# EAGLE design SH-SwitchNode-CT1 Shield (EAGLE 7.2.0)
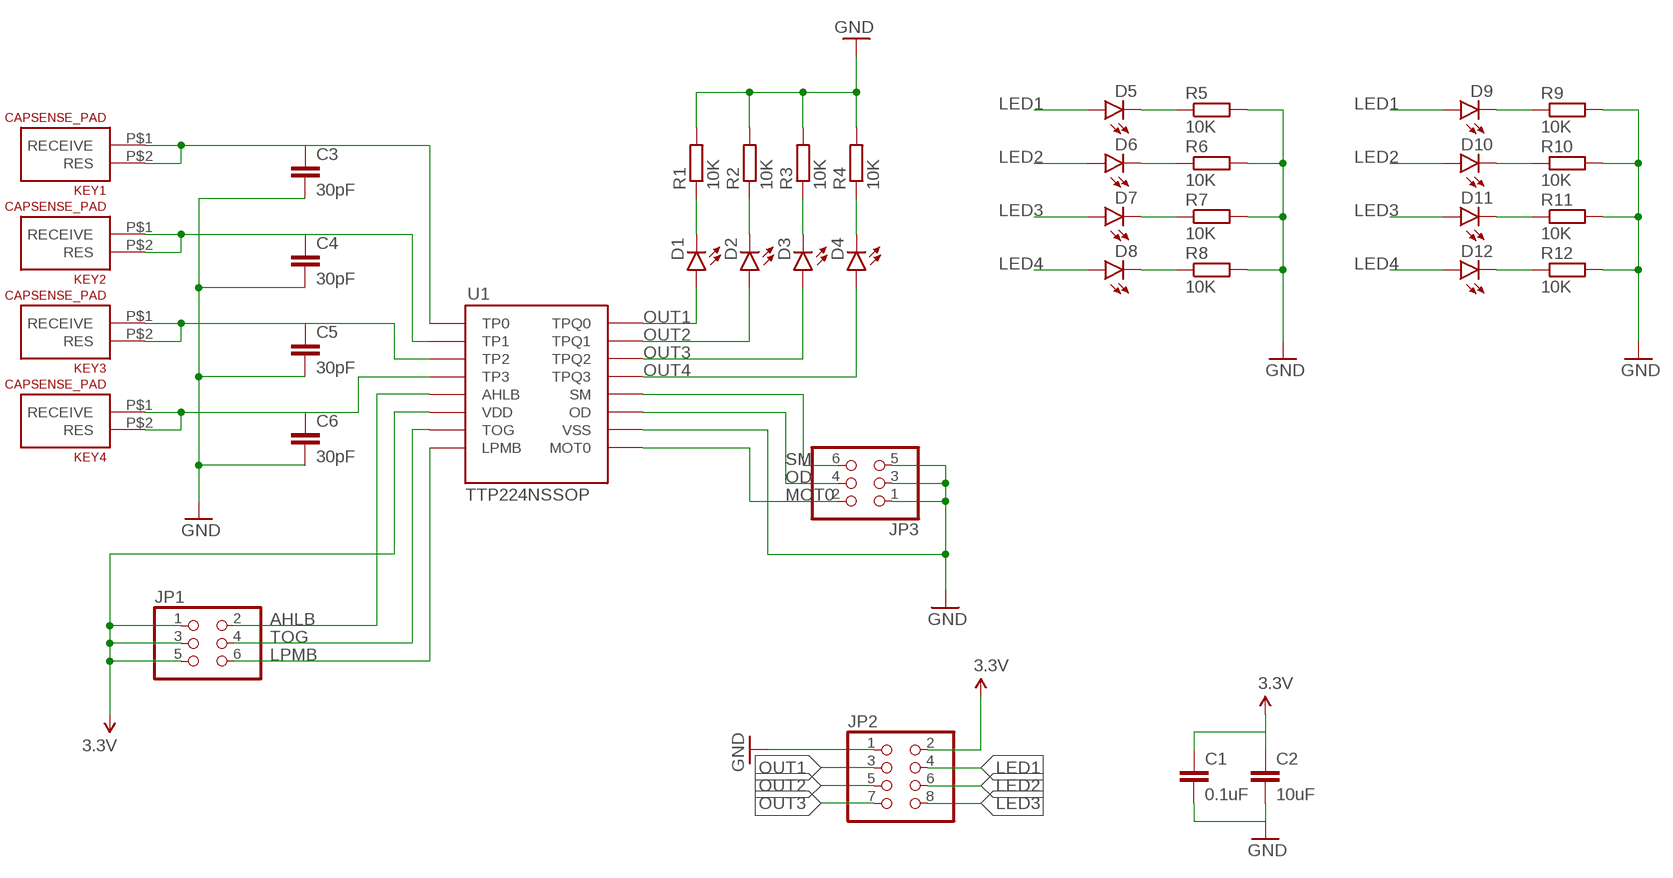
[diagram p0: schematic, sheet 1]

## Parts
C1  0.1uF  CAP0805  [0805]
C2  10uF  CAP0805  [0805]
C3  30pF  CAP0805  [0805]
C4  30pF  CAP0805  [0805]
C5  30pF  CAP0805  [0805]
C6  30pF  CAP0805  [0805]
D1  LED1206-BOTTOM  [LED-1206-BOTTOM]
D2  LED1206-BOTTOM  [LED-1206-BOTTOM]
D3  LED1206-BOTTOM  [LED-1206-BOTTOM]
D4  LED1206-BOTTOM  [LED-1206-BOTTOM]
D5  LED1206-BOTTOM  [LED-1206-BOTTOM]
D6  LED1206-BOTTOM  [LED-1206-BOTTOM]
D7  LED1206-BOTTOM  [LED-1206-BOTTOM]
D8  LED1206-BOTTOM  [LED-1206-BOTTOM]
D9  LED1206-BOTTOM  [LED-1206-BOTTOM]
D10  LED1206-BOTTOM  [LED-1206-BOTTOM]
D11  LED1206-BOTTOM  [LED-1206-BOTTOM]
D12  LED1206-BOTTOM  [LED-1206-BOTTOM]
JP1  PINHD-2X3  [2X03]
JP2  PINHD-2X4  [2X04]
JP3  PINHD-2X3  [2X03]
KEY1  CAPSENSE_PAD  [CAPSENSE_PAD]
KEY2  CAPSENSE_PAD  [CAPSENSE_PAD]
KEY3  CAPSENSE_PAD  [CAPSENSE_PAD]
KEY4  CAPSENSE_PAD  [CAPSENSE_PAD]
R1  10K  R-EU_R0805  [R0805]
R2  10K  R-EU_R0805  [R0805]
R3  10K  R-EU_R0805  [R0805]
R4  10K  R-EU_R0805  [R0805]
R5  10K  R-EU_R0805  [R0805]
R6  10K  R-EU_R0805  [R0805]
R7  10K  R-EU_R0805  [R0805]
R8  10K  R-EU_R0805  [R0805]
R9  10K  R-EU_R0805  [R0805]
R10  10K  R-EU_R0805  [R0805]
R11  10K  R-EU_R0805  [R0805]
R12  10K  R-EU_R0805  [R0805]
U1  TTP224NSSOP  [SSOP16]

## Nets
3.3V: C1.1 C2.1 JP1.1 JP1.3 JP1.5 JP2.2 U1.6(VDD)
AHLB: JP1.2 U1.5(AHLB)
GND: C1.2 C2.2 C3.2 C4.2 C5.2 C6.2 JP2.1 JP3.1 JP3.3 JP3.5 R1.2 R2.2 R3.2 R4.2 R5.2 R6.2 R7.2 R8.2 R9.2 R10.2 R11.2 R12.2 U1.10(VSS)
KEY1: C3.1 KEY1.P$1(RECEIVE) KEY1.P$2(RES) U1.1(TP0)
KEY2: C4.1 KEY2.P$1(RECEIVE) KEY2.P$2(RES) U1.2(TP1)
KEY3: C5.1 KEY3.P$1(RECEIVE) KEY3.P$2(RES) U1.3(TP2)
KEY4: C6.1 KEY4.P$1(RECEIVE) KEY4.P$2(RES) U1.4(TP3)
LED1: D5.A D9.A JP2.4
LED2: D6.A D10.A JP2.6
LED3: D7.A D11.A JP2.8
LED4: D8.A D12.A
LPMB: JP1.6 U1.8(LPMB)
MOT0: JP3.2 U1.9(MOT0)
N$6: D5.C R5.1
N$7: D6.C R6.1
N$11: D1.C R1.1
N$12: D7.C R7.1
N$13: D8.C R8.1
N$16: D9.C R9.1
N$18: D2.C R2.1
N$19: D3.C R3.1
N$20: D4.C R4.1
N$21: D10.C R10.1
N$22: D11.C R11.1
N$23: D12.C R12.1
OD: JP3.4 U1.11(OD)
OUT1: D1.A JP2.3 U1.16(TPQ0)
OUT2: D2.A JP2.5 U1.15(TPQ1)
OUT3: D3.A JP2.7 U1.14(TPQ2)
OUT4: D4.A U1.13(TPQ3)
SM: JP3.6 U1.12(SM)
TOG: JP1.4 U1.7(TOG)

## Library data of the parts
C1-C6 = SparkFun-Capacitors:CAP: Capacitor Standard 0603 ceramic capacitor, and 0.1" leaded capacitor.
D1-D12 = SparkFun-LED:LED: LEDs Standard schematic elements and footprints for 5mm, 3mm, 1206, and 0603 sized LEDs. 5mm - Spark Fun Electronics SKU : COM-00529 (and others)
JP1 JP3 = SparkFun-Connectors:PINHD-2X3: PIN HEADER
JP2 = adafruit:PINHD-2X4: PIN HEADER
KEY1-KEY4 = SparkFun-Electromechanical:CAPSENSE_PAD: Generic copper pad for a capacitive touch sensor.
R1-R12 = rcl:R-EU_: RESISTOR, European symbol
U1 = My Eagle Lib:TTP224N: The TTP224N-BSB TonTouchTM IC is capacitive sensing design specifically for touch pad controls. The device built in regulator for touch sensor. Stable sensing method can cover diversity conditions. Human interfaces control panel links through non-conductive dielectric material. The main application is focused at replacing of the mechanical switch or button. The ASSP can independently handle the 4 touch pads with 4 direct output pins.

## Board
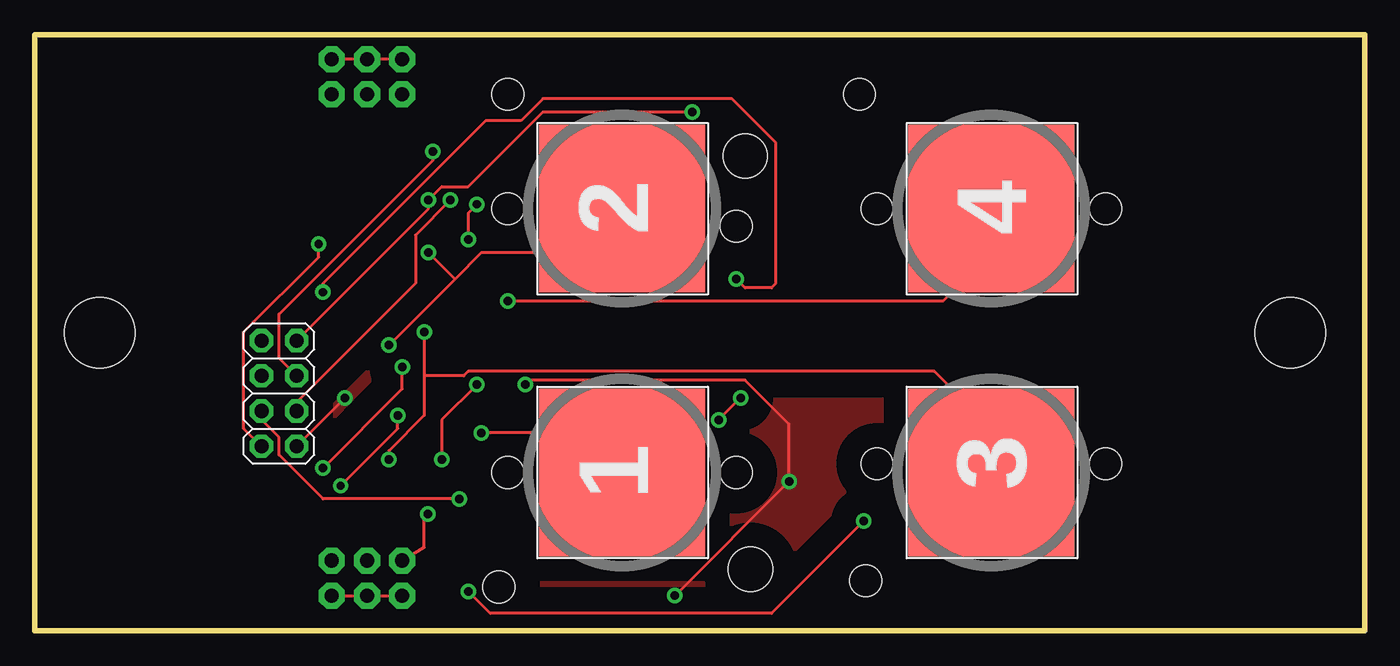
[diagram p1: board, top side]
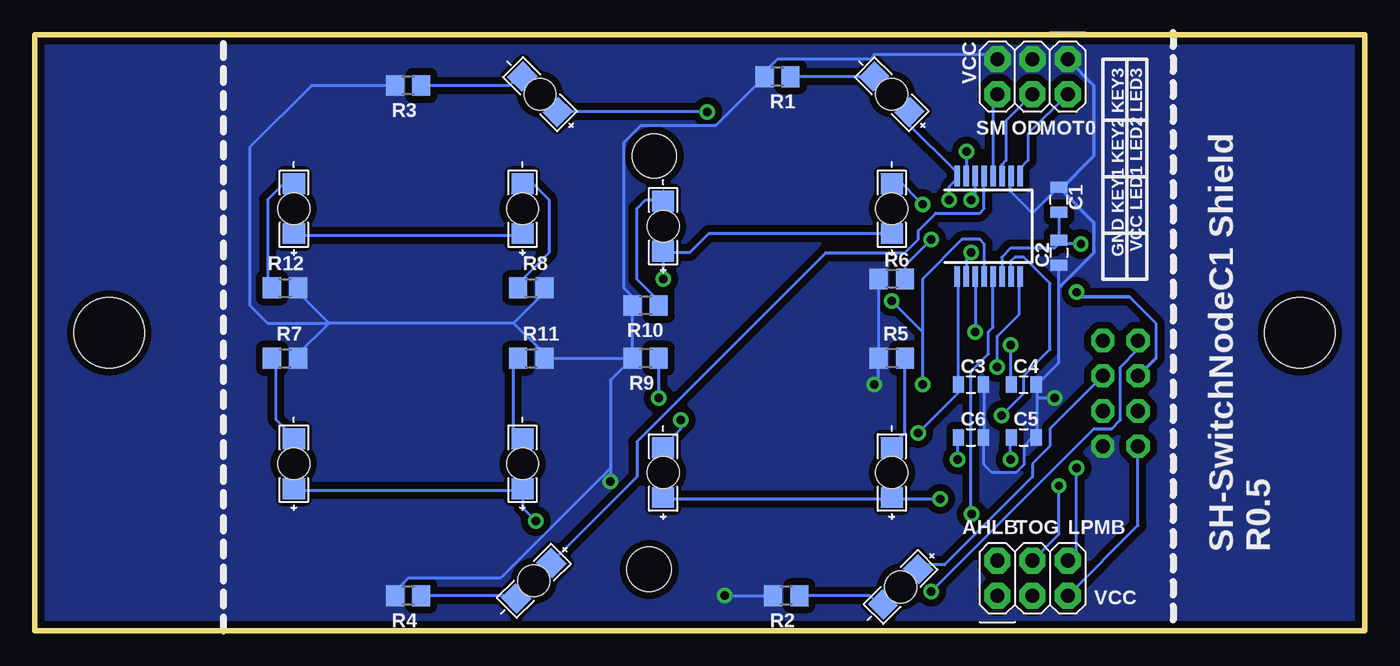
[diagram p2: board, bottom side, seen from below]

Size 96.06 x 43.04 mm. Coordinates in mm from the lower left corner, seen from the top.
Outline: 0,0 96.06,0 96.06,43.04 0,43.04 0,0
Copper layers (1*16): Top 0.035mm / dielectric 1.5mm / Bottom 0.035mm
Design rules "default *": minimum track width 9mil, minimum drill 24mil, track to track 10mil, track to pad 10mil, pad to pad 10mil, via to via 10mil, smd to smd 8mil, copper to edge 20mil, drill to drill 12mil, minimum pad ring 13mil, minimum via ring 10mil, stop-mask expansion 4mil, vias tented up to drill 0mil, thermal gap 10mil
Holes 3.2 mm at 51.31,34.29 51.69,4.45
Holes 5.08 mm at 4.7,21.52 90.68,21.52

### Footprints (pad centres in the part's own frame; a part is rotated, then mirrored left to right if it is on the bottom)
0805 = smd 0.8 x 1.2: 1 -0.9,0; 2 0.9,0
LED-1206-BOTTOM = smd 1.5 x 1.6: A -1.8,0; C 1.8,0 | hole 2.3: 0,0
2X03 = drill 1.016 pad 1.88 octagon: 1 -2.54,-1.27; 2 -2.54,1.27; 3 0,-1.27; 4 0,1.27; 5 2.54,-1.27; 6 2.54,1.27
2X04 = drill 1.016 pad 1.676 octagon: 1 -3.81,-1.27; 2 -3.81,1.27; 3 -1.27,-1.27; 4 -1.27,1.27; 5 1.27,-1.27; 6 1.27,1.27; 7 3.81,-1.27; 8 3.81,1.27
CAPSENSE_PAD = smd 12 x 6.1: P$1 0,3; P$2 0,-3
R0805 = smd 1.3 x 1.5: 1 -0.95,0; 2 0.95,0
SSOP16 = smd 0.4 x 1.5: 1 -2.275,-3.625; 2 -1.625,-3.625; 3 -0.975,-3.625; 4 -0.325,-3.625; 5 0.325,-3.625; 6 0.975,-3.625; 7 1.625,-3.625; 8 2.275,-3.625; 9 2.275,3.625; 10 1.625,3.625; 11 0.975,3.625; 12 0.325,3.625; 13 -0.325,3.625; 14 -0.975,3.625; 15 -1.625,3.625; 16 -2.275,3.625

### Placement (x,y rotation side)
C1  22.1,31.11 90 bottom
C2  22.1,27.3 270 bottom
C3  28.45,17.78 0 bottom
C4  24.64,17.78 0 bottom
C5  24.64,13.97 0 bottom
C6  28.45,13.97 0 bottom
D1  34.16,38.73 135 bottom
D2  33.53,3.17 225 bottom
D3  59.56,38.73 135 bottom
D4  60.01,3.62 225 bottom
D5  34.16,11.43 90 bottom
D6  34.16,30.48 90 bottom
D7  77.34,12.06 90 bottom
D8  60.83,30.48 90 bottom
D9  50.67,11.43 90 bottom
D10  50.67,29.21 90 bottom
D11  60.83,12.06 90 bottom
D12  77.34,30.48 90 bottom
JP1  24,3.81 0 bottom
JP2  17.65,17.14 90 top
JP3  24,40 180 bottom
KEY1  42.42,11.43 0 top
KEY2  42.42,30.48 0 top
KEY3  69.09,11.43 0 top
KEY4  69.09,30.48 0 top
R1  42.42,40 180 bottom
R2  41.78,2.54 180 bottom
R3  69.09,39.37 180 bottom
R4  69.09,2.54 180 bottom
R5  34.16,19.68 180 bottom
R6  34.16,25.4 180 bottom
R7  77.98,19.68 0 bottom
R8  60.2,24.77 0 bottom
R9  51.94,19.68 180 bottom
R10  51.94,23.49 180 bottom
R11  60.2,19.68 0 bottom
R12  77.98,24.77 0 bottom
U1  27.18,29.21 0 bottom

### Tracks (layer width: path | path; a pad name or v marks a point on that pad's centre or on a via)
3.3V  (via drill 0.61)
  Top 0.229: JP1.5 JP1.3 JP1.1 | v20.51,27.94 20.51,26.99 15.11,21.59 15.11,14.6 JP2.2
  Bottom 0.229: C1.1 C2.1 22.1,27.94 | 22.1,27.94 22.42,27.62 25.59,27.62 26.23,26.99 26.23,25.72 U1.6 | JP2.2 16.38,7.62 JP1.5 | v20.51,27.94 22.1,27.94
AHLB  (via drill 0.61)
  Top 0.229: JP1.2 28.13,6.03 28.13,8.19 v28.38,8.45
  Bottom 0.229: U1.5 26.86,25.4 26.86,21.91 27.18,21.59 27.18,20 28.45,18.73 28.45,8.51 v28.38,8.45
GND  (via drill 0.61)
  Top 0.229: JP3.1 JP3.3 JP3.5 | v22.42,16.83 JP2.1 | v46.23,2.54 v54.48,10.79 54.48,14.92 51.31,18.1 35.75,18.1 v35.43,17.78
  Bottom 0.229: JP3.5 26.86,41.59 35.43,41.59 35.75,41.27 42.42,41.27 43.05,40.64 43.05,40 R1.2 46.86,36.51 52.26,36.51 53.53,35.24 53.53,24.77 52.9,24.13 | 27.5,13.97 27.5,17.78 C3.2 | 23.69,17.78 23.69,16.83 | 23.69,16.83 23.69,13.97 C5.2 24,13.97 24.64,13.34 24.64,12 25.21,11.43 26.92,11.43 27.5,12 27.5,13.97 | C2.2 22.1,24.77 22.1,19.37 23.69,17.78 | 23.69,17.78 C4.2 | U1.10 25.59,32.7 25.59,31.75 24,30.16 22.1,32.07 C1.2 22.1,31.75 | 27.5,13.97 C6.2 | 23.69,16.83 v22.42,16.83 | 77.03,24.45 R12.2 77.03,24.45 | R7.2 77.03,20 74.8,22.22 | R8.2 59.56,24.77 59.56,24.13 61.47,22.22 | R5.2 R6.2 | v46.23,2.54 R2.2 | 54.48,11.75 54.48,18.1 R9.2 | 54.48,11.75 v54.48,10.79 | R9.2 52.9,24.13 | R9.2 R11.2 59.88,19.68 59.56,20 59.56,20.32 61.47,22.22 | 54.48,11.75 62.42,3.81 69.09,3.81 69.72,3.17 69.72,2.54 R4.2 | R5.2 35.12,18.1 v35.43,17.78 | R5.2 | 61.47,22.22 74.8,22.22 | 52.9,24.13 R10.2 | 77.03,24.45 74.8,22.22 | R3.2 76.07,39.37 80.52,34.92 80.52,23.49 79.25,22.22 74.8,22.22
  Bottom 0.254: 22.1,31.75 19.56,34.29 19.56,39.37 JP3.1 | 22.1,24.77 19.56,27.3 19.56,29.47 C1.2
  pour Top (isolate 1.778, no thermals): -3.94,46.99 100.2,46.99 100.2,-5.72 -3.94,-5.72
  pour Bottom (isolate 0.508, no thermals): -3.94,46.99 100.2,46.99 100.2,-5.72 -3.94,-5.72
KEY1  (via drill 0.61)
  Top 0.229: 42.42,14.29 v32.26,14.29 | 42.42,14.29 KEY1.P$2 | 42.42,14.29 KEY1.P$1
  Bottom 0.229: 29.4,17.78 29.4,25.4 U1.1 | 29.4,17.78 29.4,17.14 v32.26,14.29 | 29.4,17.78 C3.1
KEY2  (via drill 0.61)
  Top 0.229: 30.35,25.4 32.26,27.3 42.42,27.3 KEY2.P$2 KEY2.P$1 | 30.35,25.4 v25.59,20.64 | 30.35,25.4 v28.45,27.3
  Bottom 0.229: v25.59,20.64 25.59,17.78 C4.1 | v28.45,27.3 28.77,26.99 28.77,25.72 U1.2
KEY3  (via drill 0.61)
  Top 0.229: v25.59,12.38 25.59,13.02 28.13,15.56 28.13,18.41 | v28.13,21.59 28.13,18.41 | 28.13,18.41 30.99,18.41 31.31,18.73 64.96,18.73 69.09,14.6 KEY3.P$1 KEY3.P$2
  Bottom 0.229: v25.59,12.38 25.59,13.97 C5.1 | v28.13,21.59 28.13,25.4 U1.3
KEY4  (via drill 0.61)
  Top 0.229: v29.4,12.38 29.4,15.24 v31.94,17.78 | v34.16,23.81 65.59,23.81 69.09,27.3 KEY4.P$2 KEY4.P$1
  Bottom 0.229: v29.4,12.38 29.4,13.97 C6.1 | 31.94,21.59 31.94,25.4 29.08,28.26 27.81,28.26 27.5,27.94 27.5,25.72 U1.4 | 31.94,21.59 v31.94,17.78 | v34.16,23.81 31.94,21.59
LED1  (via drill 0.61)
  Top 0.229: JP2.4 16.38,15.24 17.65,13.97 17.65,12.7 20.83,9.52 v30.67,9.52
  Bottom 0.229: 34.16,9.52 50.67,9.52 D9.A | 34.16,9.52 v30.67,9.52 | 34.16,9.52 D5.A
LED2  (via drill 0.61)
  Top 0.229: v20.83,24.45 20.83,25.08 32.58,36.83 35.12,36.83 36.7,38.42 50.35,38.42 53.53,35.24 53.53,25.08 53.21,24.77 51.31,24.77 v50.67,25.4
  Bottom 0.229: 50.67,27.3 D10.A | 15.11,19.68 15.11,22.22 17.02,24.13 | D6.A 47.39,28.68 48.77,27.3 50.57,27.3 D10.A | D10.A v50.67,25.4
  Bottom 0.254: 17.02,24.13 20.51,24.13 v20.83,24.45 | 15.11,19.68 JP2.6
LED3  (via drill 0.61)
  Top 0.229: v31.31,2.86 32.89,1.27 53.21,1.27 v59.88,7.94
  Bottom 0.229: 60.83,10.16 77.34,10.16 D7.A | JP2.8 16.38,20.32 17.65,19.05 17.65,15.24 18.29,14.6 19.56,14.6 v31.31,2.86 | 60.83,10.16 D11.A | 60.83,10.16 60.83,8.89 v59.88,7.94
LED4
  Bottom 0.229: D8.A 60.83,28.58 77.34,28.58 D12.A
LPMB  (via drill 0.61)
  Top 0.229: v26.54,19.05 26.54,17.46 v20.83,11.75
  Bottom 0.229: v26.54,19.05 26.54,21.27 24.96,22.86 24.96,25.4 U1.8 | v20.83,11.75 20.83,5.71 JP1.6
MOT0
  Bottom 0.229: JP3.2 24.32,35.88 24.32,33.97 24.96,33.34 24.96,33.02 U1.9
N$6
  Bottom 0.229: R5.1 33.21,14.29 34.16,13.34 D5.C
N$7  (via drill 0.61)
  Top 0.229: v31.31,28.26 31.31,30.16 v31.94,30.8
  Bottom 0.229: v31.31,28.26 33.21,26.35 R6.1 | v31.94,30.8 33.85,32.7 34.16,32.38 D6.C
N$11
  Bottom 0.229: R1.1 35.75,40 D1.C
N$12
  Bottom 0.229: R7.1 78.61,19.68 78.61,15.24 77.34,13.97 D7.C
N$13
  Bottom 0.229: 60.83,24.77 R8.1 60.83,25.08 60.83,25.4 58.93,27.3 58.93,31.11 60.51,32.7 60.83,32.38 D8.C
N$16  (via drill 0.61)
  Top 0.229: v49.4,15.24 v50.99,16.83
  Bottom 0.229: v50.99,16.83 R9.1 | v49.4,15.24 49.4,14.6 50.67,13.34 D9.C
N$18
  Bottom 0.229: R2.1 35.75,2.54 35.12,1.91 D2.C
N$19
  Bottom 0.229: R3.1 61.79,39.37 61.15,40 D3.C
N$20
  Bottom 0.229: R4.1 61.47,2.54 D4.C
N$21
  Bottom 0.229: R10.1 50.99,24.13 51.31,24.13 52.58,25.4 52.58,30.48 51.94,31.11 50.78,31.11 D10.C 50.67,31.75
N$22
  Bottom 0.229: R11.1 61.47,19.68 61.47,14.6 60.83,13.97 D11.C
N$23
  Bottom 0.229: R12.1 79.25,25.09 79.25,31.11 77.98,32.38 77.34,32.38 D12.C
OD
  Bottom 0.229: JP3.4 25.91,36.83 25.91,33.97 26.23,33.66 26.23,33.02 U1.11
OUT1  (via drill 0.61)
  Top 0.229: JP2.3 18.92,16.51 27.5,25.08 27.5,28.58 v30.03,31.11
  Bottom 0.229: D1.A 32.89,37.15 33.21,36.83 29.4,33.02 U1.16 29.4,32.7 30.03,32.07 v30.03,31.11
OUT2  (via drill 0.61)
  Top 0.229: v28.77,34.61 28.77,33.97 17.65,22.86 17.65,19.68 JP2.5
  Bottom 0.229: v28.77,34.61 28.77,33.02 U1.15 | JP2.5 22.73,14.6 22.73,13.34 24,12.06 24,11.11 30.35,4.76 31.94,4.76 D2.A
OUT3  (via drill 0.61)
  Top 0.229: JP2.7 28.45,30.48 v28.45,31.11 29.4,32.07 31.31,32.07 36.7,37.47 v47.5,37.47
  Bottom 0.229: v28.45,31.11 28.13,31.43 28.13,32.7 U1.14 | v47.5,37.47 57.98,37.47 D3.A
OUT4
  Bottom 0.229: U1.13 27.5,32.7 27.5,30.48 27.81,30.16 30.99,30.16 32.26,28.89 32.26,28.26 33.21,27.3 38.92,27.3 52.58,13.65 52.58,11.11 58.61,5.08 D4.A
SM
  Bottom 0.229: JP3.6 26.86,38.42 26.86,33.02 U1.12
TOG  (via drill 0.61)
  Top 0.229: v26.23,15.56 26.23,14.6 v22.1,10.48
  Bottom 0.229: v26.23,15.56 24.64,17.14 24.64,18.41 22.73,20.32 22.73,25.08 24.64,26.99 25.27,26.99 25.59,26.67 25.59,25.72 U1.7 | v22.1,10.48 22.1,6.98 JP1.4

### Text on the board
tNames: 2 | 4 | 3 | 1
bNames: VCC | GND KEY1 KEY2 KEY3 / VCC LED1 LED2 LED3 | MOT0 | OD | SM | LPMB | TOG | AHLB | SH-SwitchNodeC1 Shield / R0.5 | VCC